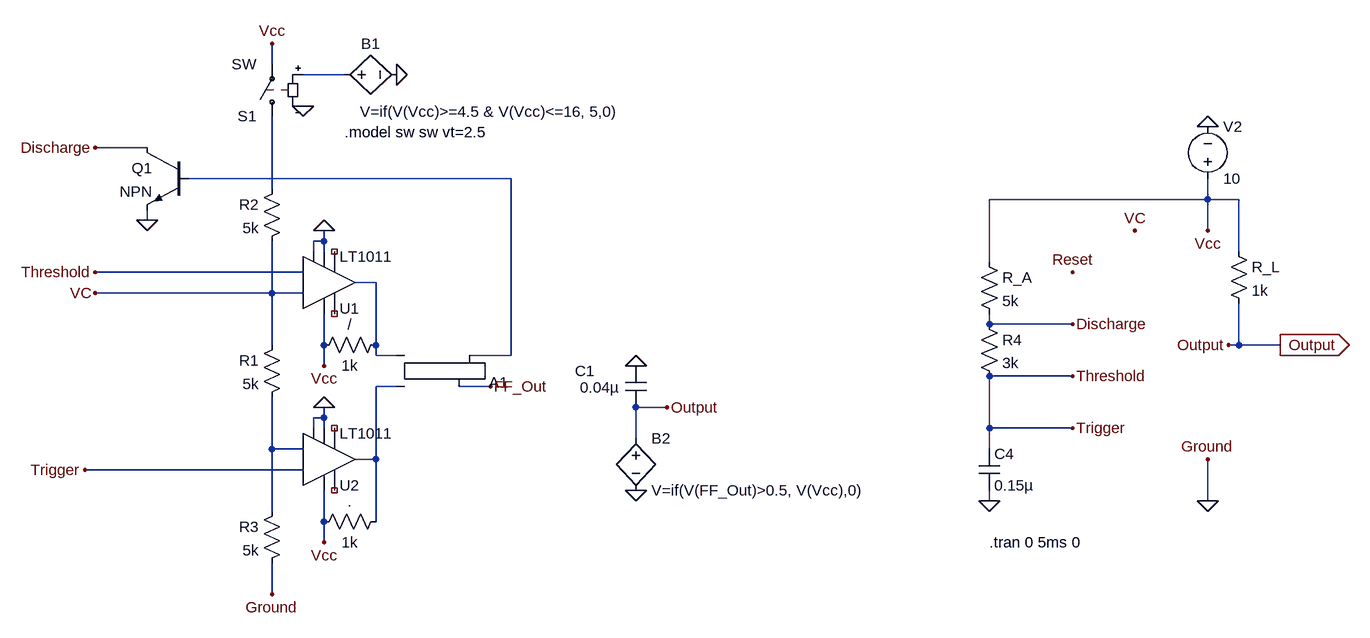
[diagram p0: schematic Astable Example.asc]
Astable Example.asc, the LTspice schematic file:
Version 4
SHEET 1 1596 680
WIRE -96 -368 -96 -400
WIRE 16 -352 -48 -352
WIRE -288 -240 -368 -240
WIRE 272 -192 -224 -192
WIRE -96 -176 -96 -288
WIRE 1344 -160 1344 -192
WIRE 1344 -160 1008 -160
WIRE 1392 -160 1344 -160
WIRE -288 -128 -288 -144
WIRE 1344 -112 1344 -160
WIRE -16 -96 -16 -112
WIRE -16 -96 -32 -96
WIRE -32 -80 -32 -96
WIRE -16 -80 -16 -96
WIRE 1392 -80 1392 -160
WIRE 1008 -64 1008 -160
WIRE -48 -48 -368 -48
WIRE 64 -32 32 -32
WIRE -96 -16 -96 -96
WIRE -96 -16 -368 -16
WIRE -48 -16 -96 -16
WIRE 1008 32 1008 16
WIRE 1136 32 1008 32
WIRE -96 64 -96 -16
WIRE -16 64 -16 16
WIRE 64 64 64 -32
WIRE 1392 64 1392 0
WIRE 1392 64 1376 64
WIRE 1456 64 1392 64
WIRE 64 80 64 64
WIRE 96 80 64 80
WIRE 272 80 272 -192
WIRE 272 80 208 80
WIRE -16 96 -16 64
WIRE 1136 112 1008 112
WIRE 96 128 64 128
WIRE 240 128 192 128
WIRE 512 160 464 160
WIRE -16 176 -16 160
WIRE -16 176 -32 176
WIRE -32 192 -32 176
WIRE -16 192 -16 176
WIRE 1008 192 1008 112
WIRE 1136 192 1008 192
WIRE 464 208 464 160
WIRE -96 224 -96 144
WIRE -48 224 -96 224
WIRE 1008 224 1008 192
WIRE 64 240 64 128
WIRE 64 240 32 240
WIRE -48 256 -384 256
WIRE 1008 304 1008 288
WIRE 1344 304 1344 240
WIRE -96 320 -96 224
WIRE -16 336 -16 288
WIRE 64 336 64 240
WIRE -16 368 -16 336
WIRE -96 448 -96 400
FLAG -16 96 Vcc
FLAG -16 368 Vcc
FLAG -96 -400 Vcc
FLAG 512 160 Output
FLAG -368 -48 Threshold
FLAG -368 -240 Discharge
FLAG -384 256 Trigger
FLAG -368 -16 VC
FLAG -96 448 Ground
FLAG 1136 192 Trigger
FLAG 1136 112 Threshold
FLAG 1136 32 Discharge
FLAG 1344 240 Ground
FLAG 1376 64 Output
FLAG 1136 -48 Reset
FLAG 1344 -112 Vcc
FLAG 1232 -112 VC
FLAG 1344 304 0
FLAG 1456 64 Output
IOPIN 1456 64 Out
FLAG 1008 304 0
FLAG 1344 -272 0
FLAG -16 -112 0
FLAG -16 160 0
FLAG -288 -128 0
FLAG -48 -304 0
FLAG 96 -352 0
FLAG 464 96 0
FLAG 464 288 0
FLAG 240 128 FF_Out
SYMBOL Digital\\srflop 144 176 M180
SYMATTR InstName A1
SYMBOL Comparators\\LT1011 -16 -32 M180
SYMATTR InstName U1
SYMBOL Comparators\\LT1011 -16 240 M180
SYMATTR InstName U2
SYMBOL npn -224 -240 M0
SYMATTR InstName Q1
SYMBOL res -80 48 M0
SYMATTR InstName R1
SYMATTR Value 5k
SYMBOL res -80 -192 M0
SYMATTR InstName R2
SYMATTR Value 5k
SYMBOL res -80 304 M0
SYMATTR InstName R3
SYMATTR Value 5k
SYMBOL res 1376 -96 R0
SYMATTR InstName R_L
SYMATTR Value 1k
SYMBOL res 992 -80 R0
SYMATTR InstName R_A
SYMATTR Value 5k
SYMBOL cap 992 224 R0
SYMATTR InstName C4
SYMATTR Value 0.15µ
SYMBOL voltage 1344 -176 M180
WINDOW 0 24 96 Left 2
WINDOW 3 24 16 Left 2
WINDOW 123 0 0 Left 0
WINDOW 39 0 0 Left 0
SYMATTR InstName V2
SYMATTR Value 10
SYMBOL res 992 16 R0
SYMATTR InstName R4
SYMATTR Value 3k
SYMBOL res 80 48 R90
WINDOW 0 0 56 VBottom 2
WINDOW 3 32 56 VTop 2
SYMATTR InstName /
SYMATTR Value 1k
SYMBOL res 80 320 R90
WINDOW 0 0 56 VBottom 2
WINDOW 3 32 56 VTop 2
SYMATTR InstName .
SYMATTR Value 1k
SYMBOL sw -96 -272 R180
SYMATTR InstName S1
SYMBOL bv 0 -352 R270
WINDOW 0 32 56 VTop 2
WINDOW 3 -41 238 VBottom 2
SYMATTR InstName B1
SYMATTR Value V=if(V(Vcc)>=4.5 & V(Vcc)<=16, 5,0)
SYMBOL cap 480 160 R180
WINDOW 0 79 56 Left 2
WINDOW 3 41 31 Left 2
SYMATTR InstName C1
SYMATTR Value 0.04µ
SYMBOL bv 464 192 R0
SYMATTR InstName B2
SYMATTR Value V=if(V(FF_Out)>0.5, V(Vcc),0)
TEXT 1008 368 Left 2 !.tran 0 5ms 0
TEXT 16 -264 Left 2 !.model sw sw vt=2.5

The netlist it stands for:
* Astable Example.asc
A1 N005 N004 0 0 0 N002 FF_Out 0 SRFLOP
XU1 0 Trigger VC 0 NC_01 NC_02 N004 Vcc LT1011
XU2 0 N006 Trigger 0 NC_03 NC_04 N005 Vcc LT1011
Q1 Discharge N002 0 0 NPN
R1 VC N006 5k
R2 N003 VC 5k
R3 N006 0 5k
R_L Vcc Output 1k
R_A Vcc Discharge 5k
C4 Trigger 0 0.15µ
V2 Vcc 0 10
R4 Discharge Trigger 3k
R§/ N004 Vcc 1k
R§. N005 Vcc 1k
S1 N003 Vcc N001 0 SW
B1 N001 0 V=if(V(Vcc)>=4.5 & V(Vcc)<=16, 5,0)
C1 Output 0 0.04µ
B2 Output 0 V=if(V(FF_Out)>0.5, V(Vcc),0)
.model NPN NPN
.model PNP PNP
.lib standard.bjt
.tran 0 5ms 0
.model sw sw vt=2.5
.lib LTC1.lib
.backanno
.end